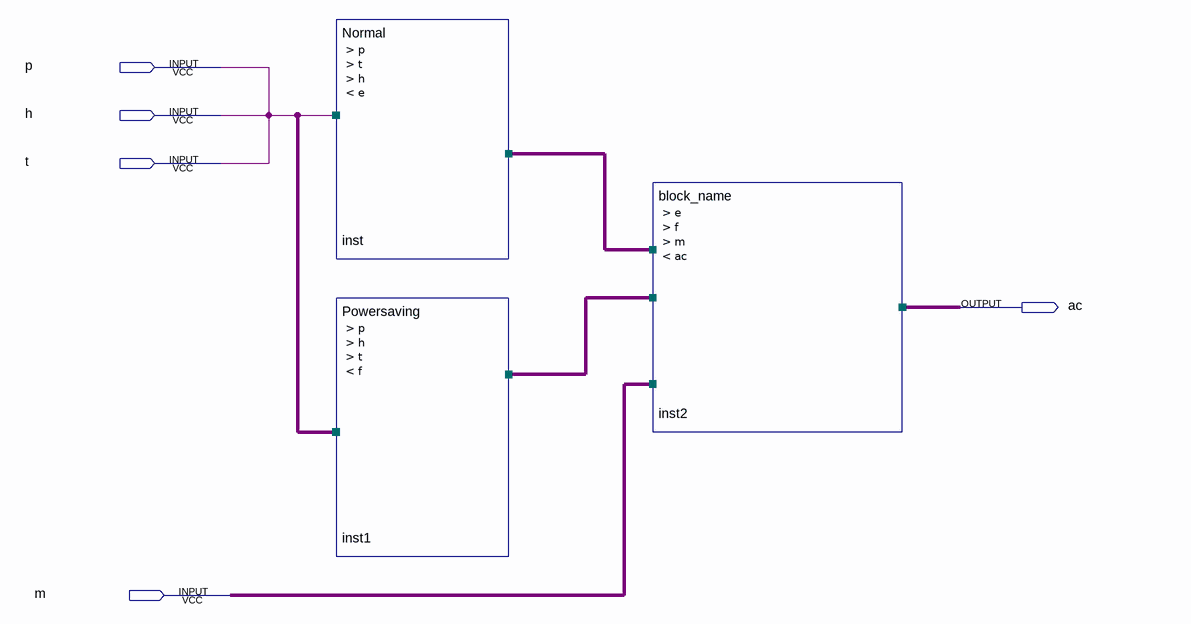
[diagram p0: schematic sheet]
// Quartus schematic ac.bdf as structural Verilog: 3 symbols, 5 pins
module ac (
  input  p,
  input  h,
  input  t,
  input  m,
  output ac
);

  wire e, f;

  Normal inst (.p(h), .e(e));  // open: t, h
  Powersaving inst1 (.p(h), .h(h), .t(h), .f(f));
  block_name inst2 (.e(e), .f(f), .m(m), .ac(ac));

  assign p = h;
  assign t = h;
endmodule
